# Altium schematic sheet 1_reference.SchDoc
size 431 x 279 mm; Organization: ORGANIZATION; Address1: ADDRESS 1; Address2: ADDRESS 2; Address3: ADDRESS 3; Address4: ADDRESS 4; Revision: -; ENG_APP_DATE: --/--/--; DSN_APP_DATE: --/--/--; CHK_APP_DATE: --/--/--
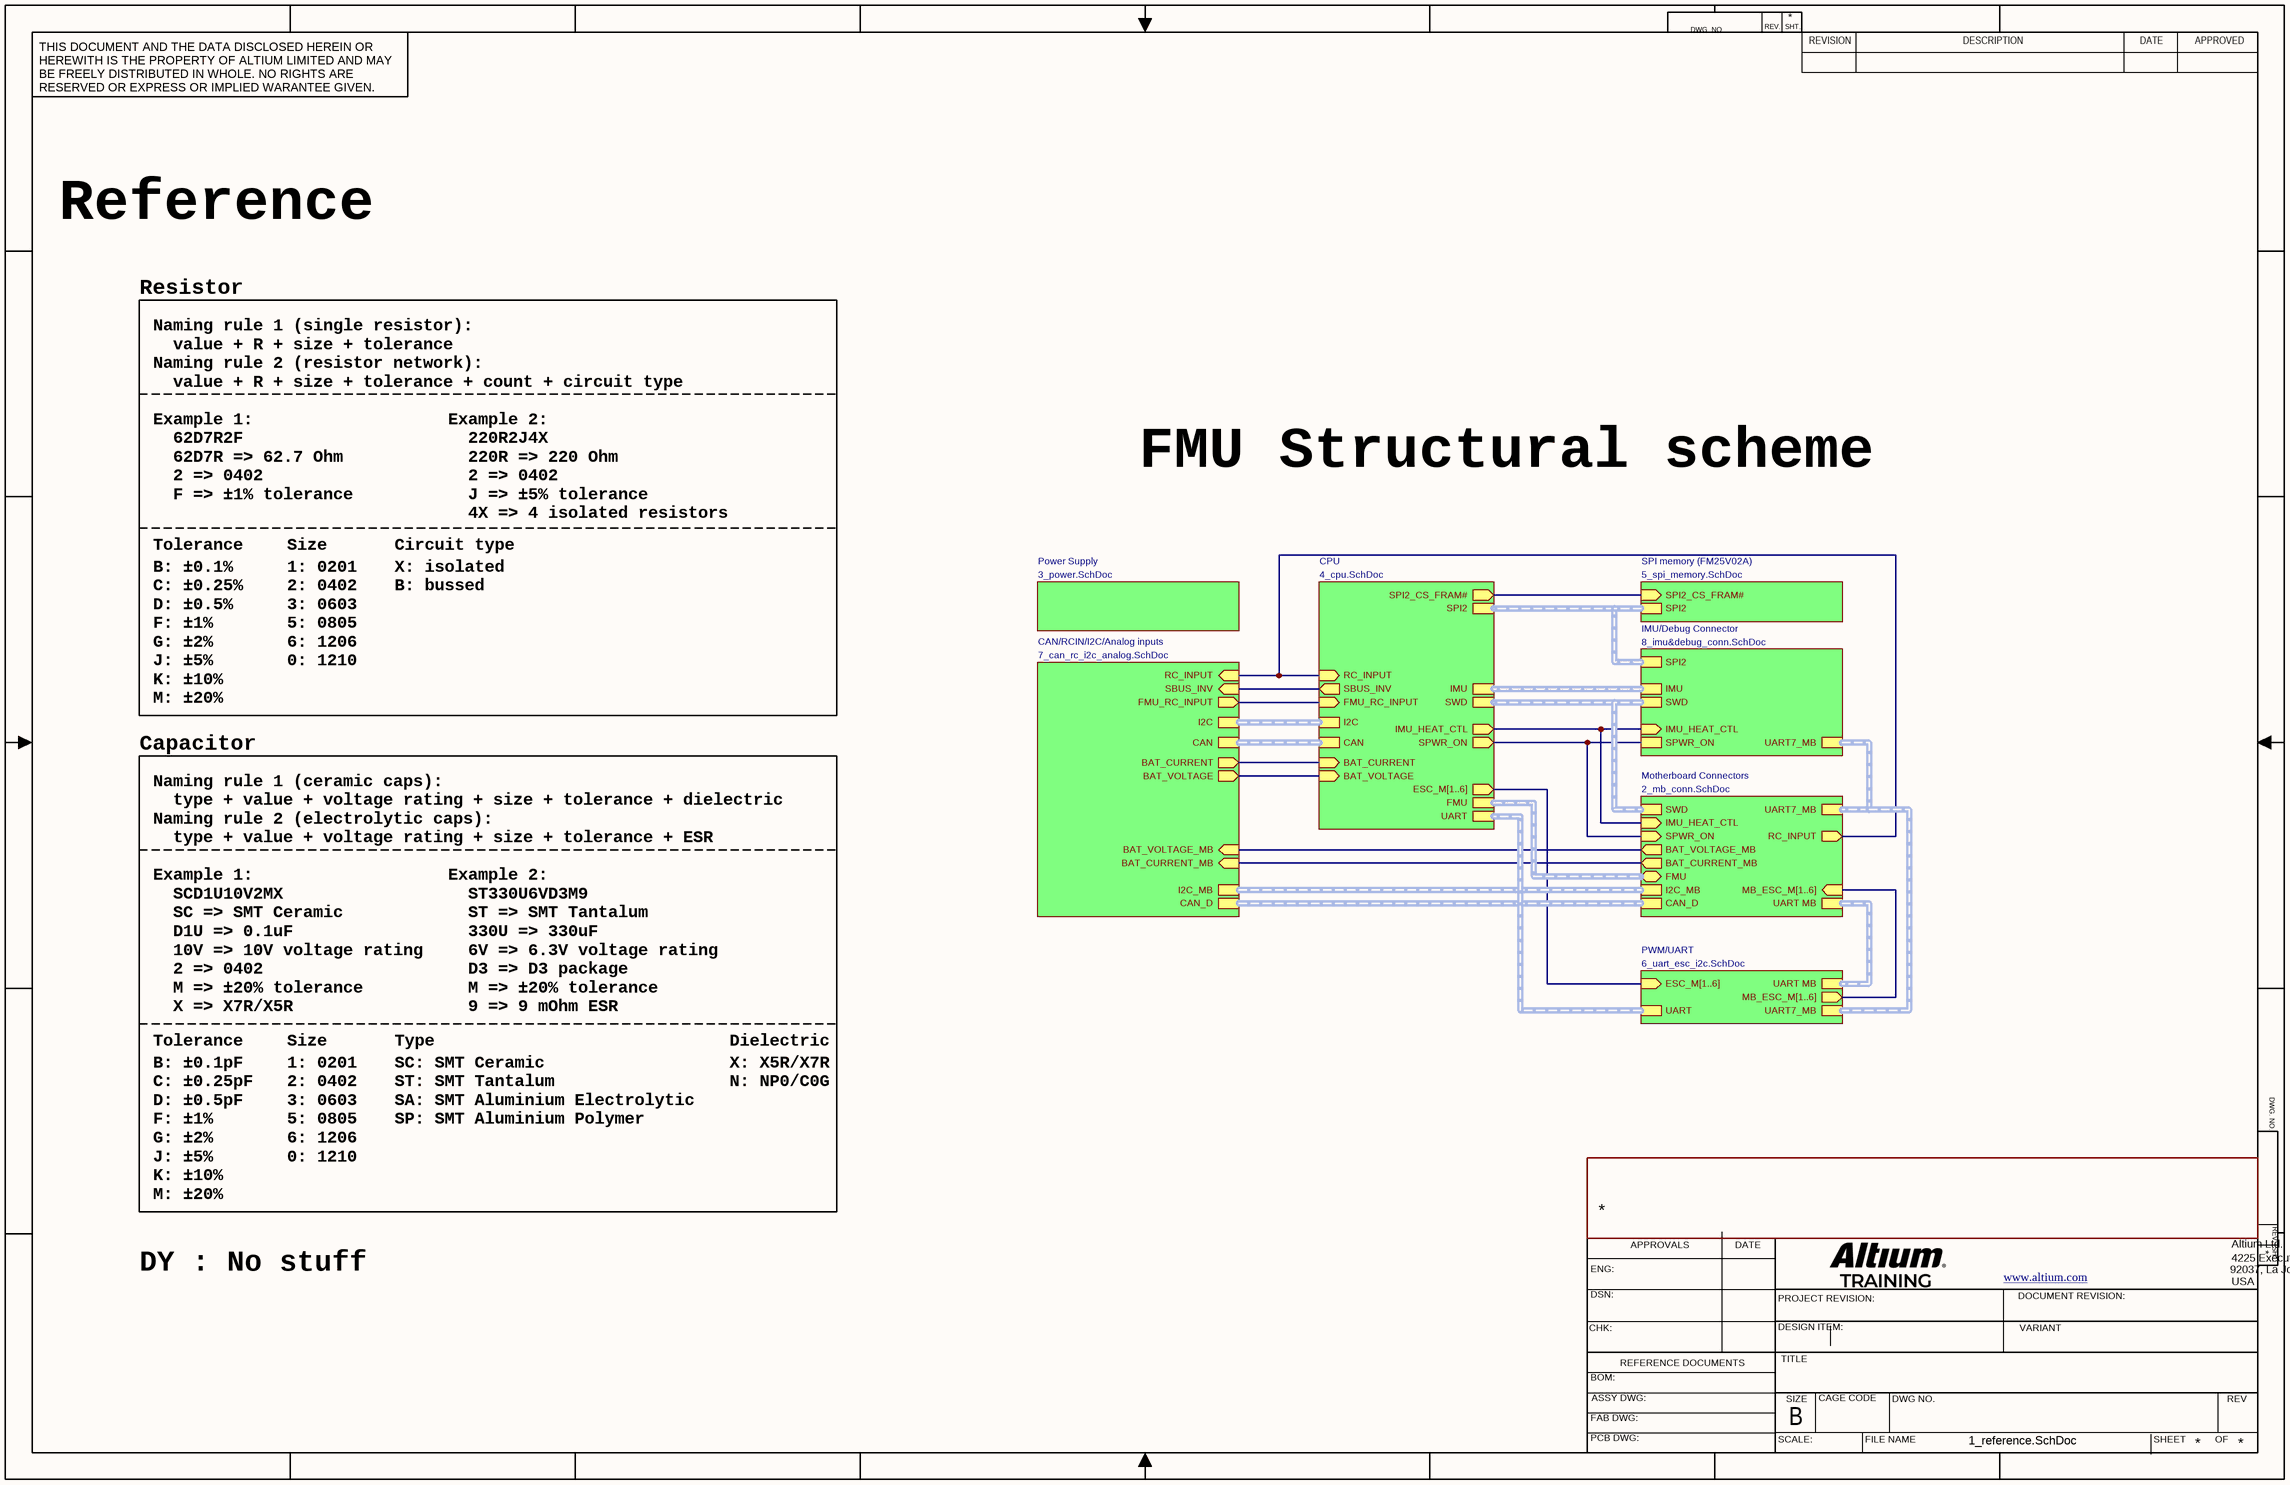
[diagram p0: 1_reference.SchDoc]

## Sub-sheets
CAN/RCIN/I2C/Analog inputs = 7_can_rc_i2c_analog.SchDoc: FMU_RC_INPUT (out), CAN_D (harness CAN_D), BAT_VOLTAGE (out), I2C (harness I2C), BAT_CURRENT (out), I2C_MB (harness I2C_MB), RC_INPUT (in), SBUS_INV (in), BAT_CURRENT_MB (in), BAT_VOLTAGE_MB (in), CAN (harness CAN)  | Parameter 1: CAN/RCIN/I2C/Analog inputs
CPU = 4_cpu.SchDoc: UART (harness UART), SWD (harness SWD), SPI2 (harness SPI2), IMU (harness IMU), IMU_HEAT_CTL (out), SPWR_ON (out), SBUS_INV (out), I2C (harness I2C), FMU_RC_INPUT (in), RC_INPUT (in), CAN (harness CAN), BAT_CURRENT (in), BAT_VOLTAGE (in), ESC_M[1..6] (out), SPI2_CS_FRAM# (out), FMU (harness FMU)  | Parameter 1: CPU
IMU/Debug Connector = 8_imu&debug_conn.SchDoc: IMU (harness IMU), SPI2 (harness SPI2), IMU_HEAT_CTL (in), SPWR_ON, UART7_MB (harness UART7_MB), SWD (harness SWD)  | Parameter 1: IMU/Debug Connector
Motherboard Connectors = 2_mb_conn.SchDoc: UART7_MB (harness UART7_MB), SWD (harness SWD), IMU_HEAT_CTL (in), SPWR_ON (in), CAN_D (harness CAN_D), I2C_MB (harness I2C_MB), BAT_VOLTAGE_MB (out), BAT_CURRENT_MB (out), UART MB (harness UART_MB), MB_ESC_M[1..6] (in), RC_INPUT (out), FMU (bidir, harness FMU)  | Parameter 1: Motherboard connectors
Power Supply = 3_power.SchDoc: no entries
PWM/UART = 6_uart_esc_i2c.SchDoc: MB_ESC_M[1..6] (out), ESC_M[1..6] (in), UART (harness UART), UART MB (harness UART_MB), UART7_MB (harness UART7_MB)  | Parameter 1: PWM/UART
SPI memory (FM25V02A) = 5_spi_memory.SchDoc: SPI2 (harness SPI2), SPI2_CS_FRAM# (in)  | Parameter 1: SPI memory (FM25V02A)

## Nets
(unnamed): sheet IMU/Debug Connector/IMU_HEAT_CTL, sheet Motherboard Connectors/IMU_HEAT_CTL, sheet CPU/IMU_HEAT_CTL
(unnamed): sheet IMU/Debug Connector/SPWR_ON, sheet Motherboard Connectors/SPWR_ON, sheet CPU/SPWR_ON
(unnamed): sheet Motherboard Connectors/BAT_VOLTAGE_MB, sheet CAN/RCIN/I2C/Analog inputs/BAT_VOLTAGE_MB
(unnamed): sheet Motherboard Connectors/BAT_CURRENT_MB, sheet CAN/RCIN/I2C/Analog inputs/BAT_CURRENT_MB
(unnamed): sheet Motherboard Connectors/RC_INPUT, sheet CPU/RC_INPUT, sheet CAN/RCIN/I2C/Analog inputs/RC_INPUT
(unnamed): sheet CPU/SBUS_INV, sheet CAN/RCIN/I2C/Analog inputs/SBUS_INV
(unnamed): sheet CPU/FMU_RC_INPUT, sheet CAN/RCIN/I2C/Analog inputs/FMU_RC_INPUT
(unnamed): sheet CPU/BAT_CURRENT, sheet CAN/RCIN/I2C/Analog inputs/BAT_CURRENT
(unnamed): sheet CPU/BAT_VOLTAGE, sheet CAN/RCIN/I2C/Analog inputs/BAT_VOLTAGE
(unnamed): sheet CPU/SPI2_CS_FRAM#, sheet SPI memory (FM25V02A)/SPI2_CS_FRAM#

## Buses and harness runs
bus sheet CPU/ESC_M[1..6] = sheet PWM/UART/ESC_M[1..6]
bus sheet Motherboard Connectors/MB_ESC_M[1..6] = sheet PWM/UART/MB_ESC_M[1..6]
harness sheet CAN/RCIN/I2C/Analog inputs/CAN = sheet CPU/CAN
harness sheet CAN/RCIN/I2C/Analog inputs/CAN_D = sheet Motherboard Connectors/CAN_D
harness sheet CAN/RCIN/I2C/Analog inputs/I2C = sheet CPU/I2C
harness sheet CAN/RCIN/I2C/Analog inputs/I2C_MB = sheet Motherboard Connectors/I2C_MB
harness sheet CPU/FMU = sheet Motherboard Connectors/FMU
harness sheet CPU/IMU = sheet IMU/Debug Connector/IMU
harness sheet CPU/SPI2 = sheet IMU/Debug Connector/SPI2 = sheet SPI memory (FM25V02A)/SPI2
harness sheet CPU/SWD = sheet IMU/Debug Connector/SWD = sheet Motherboard Connectors/SWD
harness sheet CPU/UART = sheet PWM/UART/UART
harness sheet IMU/Debug Connector/UART7_MB = sheet Motherboard Connectors/UART7_MB = sheet PWM/UART/UART7_MB
harness sheet Motherboard Connectors/UART MB = sheet PWM/UART/UART MB

## Notes on the sheet
- Reference
- Resistor
- Naming rule 1 (single resistor):
  value + R + size + tolerance
  Naming rule 2 (resistor network):
  value + R + size + tolerance + count + circuit type
- Example 1:
  62D7R2F
  62D7R => 62.7 Ohm
  2 => 0402
  F => ±1% tolerance
- FMU Structural scheme
- Tolerance
- Size
- Circuit type
- Example 2:
  220R2J4X
  220R => 220 Ohm
  2 => 0402
  J => ±5% tolerance
  4X => 4 isolated resistors
- B: ±0.1%
  C: ±0.25%
  D: ±0.5%
  F: ±1%
  G: ±2%
  J: ±5%
  K: ±10%
  M: ±20%
- 1: 0201
  2: 0402
  3: 0603
  5: 0805
  6: 1206
  0: 1210
- X: isolated
  B: bussed
- Capacitor
- Naming rule 1 (ceramic caps):
  type + value + voltage rating + size + tolerance + dielectric
  Naming rule 2 (electrolytic caps):
  type + value + voltage rating + size + tolerance + ESR
- Example 1:
  SCD1U10V2MX
  SC => SMT Ceramic
  D1U => 0.1uF
  10V => 10V voltage rating
  2 => 0402
  M => ±20% tolerance
  X => X7R/X5R
- Example 2:
  ST330U6VD3M9
  ST => SMT Tantalum
  330U => 330uF
  6V => 6.3V voltage rating
  D3 => D3 package
  M => ±20% tolerance
  9 => 9 mOhm ESR
- Type
- Dielectric
- B: ±0.1pF
  C: ±0.25pF
  D: ±0.5pF
  F: ±1%
  G: ±2%
  J: ±5%
  K: ±10%
  M: ±20%
- SC: SMT Ceramic
  ST: SMT Tantalum
  SA: SMT Aluminium Electrolytic
  SP: SMT Aluminium Polymer
- X: X5R/X7R
  N: NP0/C0G
- DY : No stuff
- DWG. NO.
- REV.
- SHT.
- THIS DOCUMENT AND THE DATA DISCLOSED HEREIN OR HEREWITH IS THE PROPERTY OF ALTIUM LIMITED AND MAY BE FREELY DISTRIBUTED IN WHOLE. NO RIGHTS ARE RESERVED OR EXPRESS OR IMPLIED WARANTEE GIVEN.
- REVISION
- DESCRIPTION
- DATE
- APPROVED
- ENG:
- DSN:
- APPROVALS
- PROJECT REVISION:
- www.altium.com <http://www.altium.com>
- DOCUMENT REVISION:
- 92037, La Jolla
- USA
- Altium Ltd.
- 4225 Executive Square
- CHK:
- REFERENCE DOCUMENTS
- DESIGN ITEM:
- TITLE
- VARIANT
- BOM:
- FAB DWG:
- PCB DWG:
- ASSY DWG:
- SCALE:
- SIZE
- B
- CAGE CODE
- FILE NAME
- DWG NO.
- SHEET
- OF
- REV